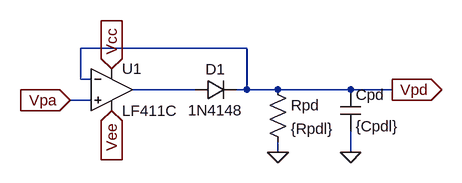
[diagram p0: schematic peakdetector_lab7.asc]
peakdetector_lab7.asc, the LTspice schematic file:
Version 4
SHEET 1 880 680
WIRE 240 112 -16 112
WIRE -16 160 -16 112
WIRE 0 160 -16 160
WIRE 160 176 64 176
WIRE 240 176 240 112
WIRE 240 176 224 176
WIRE 288 176 240 176
WIRE 400 176 288 176
WIRE 464 176 400 176
WIRE 0 192 -32 192
WIRE 288 272 288 256
WIRE 400 272 400 240
FLAG -32 192 Vpa
IOPIN -32 192 In
FLAG 32 144 Vcc
IOPIN 32 144 In
FLAG 32 208 Vee
IOPIN 32 208 In
FLAG 464 176 Vpd
IOPIN 464 176 Out
FLAG 288 272 0
FLAG 400 272 0
SYMBOL diode 160 192 R270
WINDOW 0 32 32 VTop 2
WINDOW 3 0 32 VBottom 2
SYMATTR InstName D1
SYMATTR Value 1N4148
SYMBOL res 272 160 R0
SYMATTR InstName Rpd
SYMATTR Value {Rpdl}
SYMBOL cap 384 176 R0
SYMATTR InstName Cpd
SYMATTR Value {Cpdl}
SYMBOL OpAmps\\opamp2 32 112 R0
SYMATTR InstName U1
SYMATTR Value LF411C

The netlist it stands for:
* peakdetector_lab7.asc
D1 N001 Vpd 1N4148
Rpd Vpd 0 {Rpdl}
Cpd Vpd 0 {Cpdl}
XU1 Vpa Vpd Vcc Vee N001 LF411C  ; pins In+ In- V+ V- OUT
.model D D
.lib standard.dio
.backanno
.end